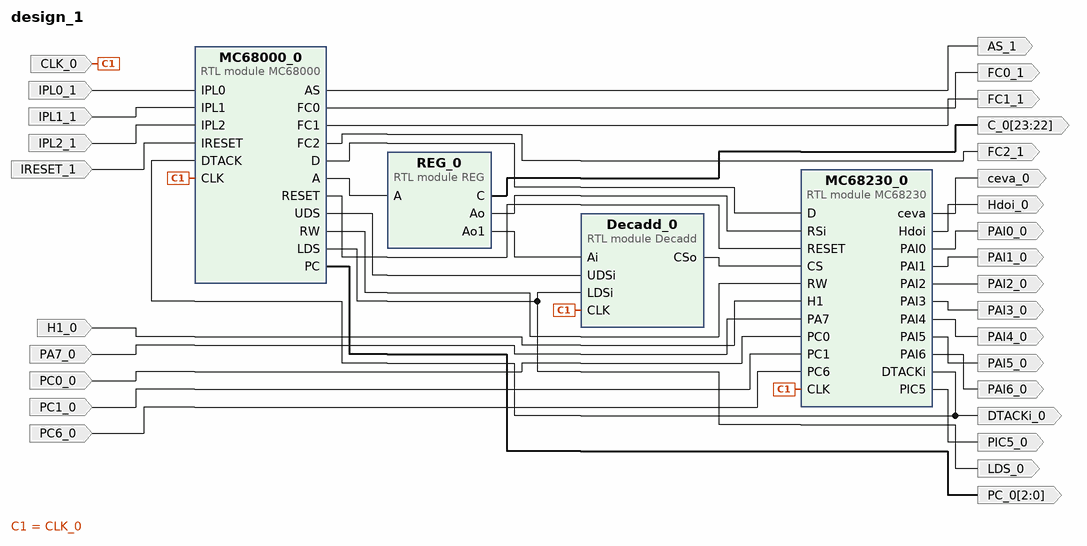
[diagram p0: block diagram of the top level]
# Vivado block design design_1, xc7a100tcsg324-1, Vivado 2021.1
create_bd_design design_1

create_bd_port -dir O ceva_0
create_bd_port -dir O Hdoi_0
create_bd_port -dir O PAI6_0
create_bd_port -dir I -type clk CLK_0
create_bd_port -dir I H1_0
create_bd_port -dir I PC0_0
create_bd_port -dir I PC1_0
create_bd_port -dir O -from 23 -to 22 C_0
create_bd_port -dir O PAI5_0
create_bd_port -dir O PAI4_0
create_bd_port -dir O PAI3_0
create_bd_port -dir O PAI2_0
create_bd_port -dir O PAI1_0
create_bd_port -dir O PAI0_0
create_bd_port -dir I PA7_0
create_bd_port -dir O LDS_0
create_bd_port -dir O PIC5_0
create_bd_port -dir I PC6_0
create_bd_port -dir O FC2_1
create_bd_port -dir O FC1_1
create_bd_port -dir O FC0_1
create_bd_port -dir O AS_1
create_bd_port -dir O -from 2 -to 0 PC_0
create_bd_port -dir O DTACKi_0
create_bd_port -dir I IPL2_1
create_bd_port -dir I IPL1_1
create_bd_port -dir I IPL0_1
create_bd_port -dir I IRESET_1

create_bd_cell -type module -reference MC68230 MC68230_0
create_bd_cell -type module -reference REG REG_0
create_bd_cell -type module -reference Decadd Decadd_0
create_bd_cell -type module -reference MC68000 MC68000_0

# ---- connections ----

connect_bd_net -net CLK_0_1 [get_bd_ports CLK_0] [get_bd_pins MC68230_0/CLK] [get_bd_pins Decadd_0/CLK] [get_bd_pins MC68000_0/CLK]
connect_bd_net [get_bd_pins Decadd_0/CSo] [get_bd_pins MC68230_0/CS]
connect_bd_net -net H1_0_1 [get_bd_ports H1_0] [get_bd_pins MC68230_0/H1]
connect_bd_net -net IPL0_1_1 [get_bd_ports IPL0_1] [get_bd_pins MC68000_0/IPL0]
connect_bd_net -net IPL1_1_1 [get_bd_ports IPL1_1] [get_bd_pins MC68000_0/IPL1]
connect_bd_net -net IPL2_1_1 [get_bd_ports IPL2_1] [get_bd_pins MC68000_0/IPL2]
connect_bd_net -net IRESET_1_1 [get_bd_ports IRESET_1] [get_bd_pins MC68000_0/IRESET]
connect_bd_net [get_bd_pins MC68000_0/A] [get_bd_pins REG_0/A]
connect_bd_net [get_bd_pins MC68000_0/AS] [get_bd_ports AS_1]
connect_bd_net [get_bd_pins MC68000_0/D] [get_bd_pins MC68230_0/D]
connect_bd_net [get_bd_pins MC68000_0/FC0] [get_bd_ports FC0_1]
connect_bd_net [get_bd_pins MC68000_0/FC1] [get_bd_ports FC1_1]
connect_bd_net [get_bd_pins MC68000_0/FC2] [get_bd_ports FC2_1]
connect_bd_net [get_bd_pins MC68000_0/PC] [get_bd_ports PC_0]
connect_bd_net [get_bd_pins MC68000_0/RESET] [get_bd_pins MC68230_0/RESET]
connect_bd_net [get_bd_pins MC68000_0/RW] [get_bd_pins MC68230_0/RW]
connect_bd_net [get_bd_pins MC68000_0/UDS] [get_bd_pins Decadd_0/UDSi]
connect_bd_net -net MC68000p_0_LDS [get_bd_pins MC68000_0/LDS] [get_bd_ports LDS_0] [get_bd_pins Decadd_0/LDSi]
connect_bd_net [get_bd_pins MC68230_0/DTACKi] [get_bd_ports DTACKi_0] [get_bd_pins MC68000_0/DTACK]
connect_bd_net [get_bd_pins MC68230_0/Hdoi] [get_bd_ports Hdoi_0]
connect_bd_net [get_bd_pins MC68230_0/PAI0] [get_bd_ports PAI0_0]
connect_bd_net [get_bd_pins MC68230_0/PAI1] [get_bd_ports PAI1_0]
connect_bd_net [get_bd_pins MC68230_0/PAI2] [get_bd_ports PAI2_0]
connect_bd_net [get_bd_pins MC68230_0/PAI3] [get_bd_ports PAI3_0]
connect_bd_net [get_bd_pins MC68230_0/PAI4] [get_bd_ports PAI4_0]
connect_bd_net [get_bd_pins MC68230_0/PAI5] [get_bd_ports PAI5_0]
connect_bd_net [get_bd_pins MC68230_0/PAI6] [get_bd_ports PAI6_0]
connect_bd_net [get_bd_pins MC68230_0/PIC5] [get_bd_ports PIC5_0]
connect_bd_net [get_bd_pins MC68230_0/ceva] [get_bd_ports ceva_0]
connect_bd_net -net PA7_0_1 [get_bd_ports PA7_0] [get_bd_pins MC68230_0/PA7]
connect_bd_net -net PC0_0_1 [get_bd_ports PC0_0] [get_bd_pins MC68230_0/PC0]
connect_bd_net -net PC1_0_1 [get_bd_ports PC1_0] [get_bd_pins MC68230_0/PC1]
connect_bd_net -net PC6_0_1 [get_bd_ports PC6_0] [get_bd_pins MC68230_0/PC6]
connect_bd_net [get_bd_pins REG_0/Ao] [get_bd_pins MC68230_0/RSi]
connect_bd_net [get_bd_pins REG_0/Ao1] [get_bd_pins Decadd_0/Ai]
connect_bd_net [get_bd_pins REG_0/C] [get_bd_ports C_0]

validate_bd_design
save_bd_design
